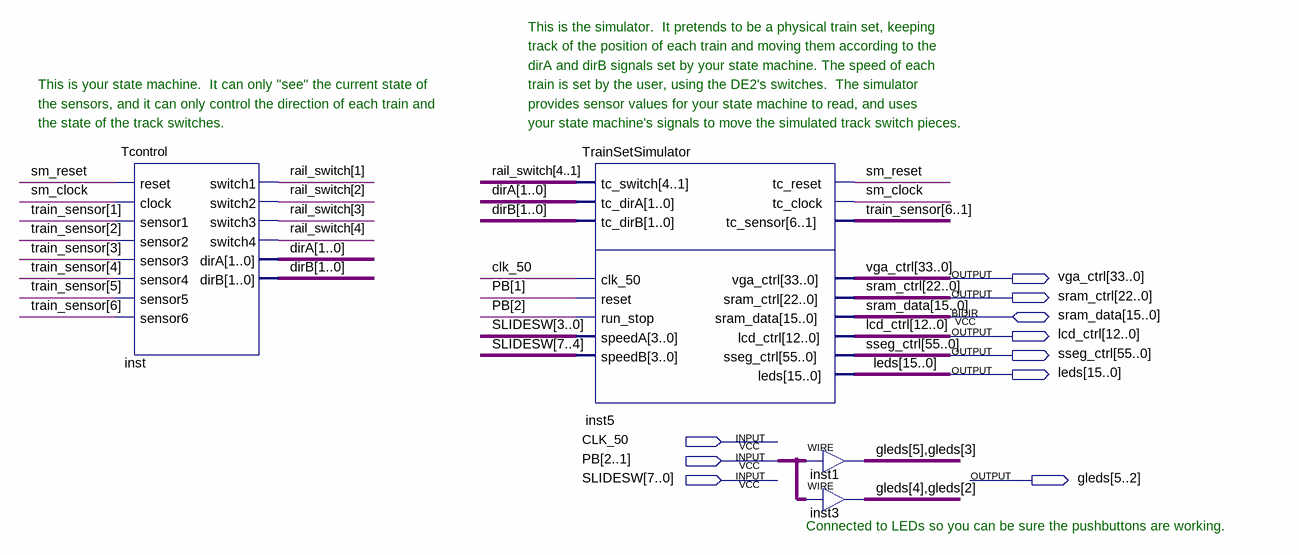
[diagram p0: schematic sheet]
// Quartus schematic TrainTop.bdf as structural Verilog: 4 symbols, 10 pins
module TrainTop (
  input  CLK_50,
  input  [2:1] PB,
  input  [7:0] SLIDESW,
  inout  [15:0] sram_data,
  output [33:0] vga_ctrl,
  output [22:0] sram_ctrl,
  output [12:0] lcd_ctrl,
  output [55:0] sseg_ctrl,
  output [15:0] leds,
  output [5:2] gleds
);

  wire sm_clock, sm_reset;
  wire [1:0] dirA, dirB;
  wire [4:1] rail_switch;
  wire [6:1] train_sensor;

  Tcontrol inst (
    .reset(sm_reset), .clock(sm_clock), .sensor1(train_sensor[1]), .sensor2(train_sensor[2]),
    .sensor3(train_sensor[3]), .sensor4(train_sensor[4]), .sensor5(train_sensor[5]),
    .sensor6(train_sensor[6]), .switch1(rail_switch[1]), .switch2(rail_switch[2]), .switch3(rail_switch[3]),
    .switch4(rail_switch[4]), .dirA(dirA), .dirB(dirB));
  TrainSetSimulator inst5 (
    .tc_switch(rail_switch), .tc_dirA(dirA), .tc_dirB(dirB), .clk_50(CLK_50), .reset(PB[1]),
    .run_stop(PB[2]), .speedA(SLIDESW[3:0]), .speedB(SLIDESW[7:4]), .tc_reset(sm_reset), .tc_clock(sm_clock),
    .tc_sensor(train_sensor), .vga_ctrl(vga_ctrl), .sram_ctrl(sram_ctrl), .lcd_ctrl(lcd_ctrl),
    .sseg_ctrl(sseg_ctrl), .leds(leds), .sram_data(sram_data));
  assign {gleds[5], gleds[3]} = PB;  // WIRE inst1
  assign {gleds[4], gleds[2]} = PB;  // WIRE inst3

  // Notes on the sheet:
  //   This is the simulator.  It pretends to be a physical train set, keeping
  //   track of the position of each train and moving them according to the
  //   dirA and dirB signals set by your state machine. The speed of each
  //   This is your state machine.  It can only "see" the current state of
  //   train is set by the user, using the DE2's switches.  The simulator
  //   the sensors, and it can only control the direction of each train and
  //   provides sensor values for your state machine to read, and uses
  //   the state of the track switches.
  //   your state machine's signals to move the simulated track switch pieces.
  //   Connected to LEDs so you can be sure the pushbuttons are working.
endmodule
